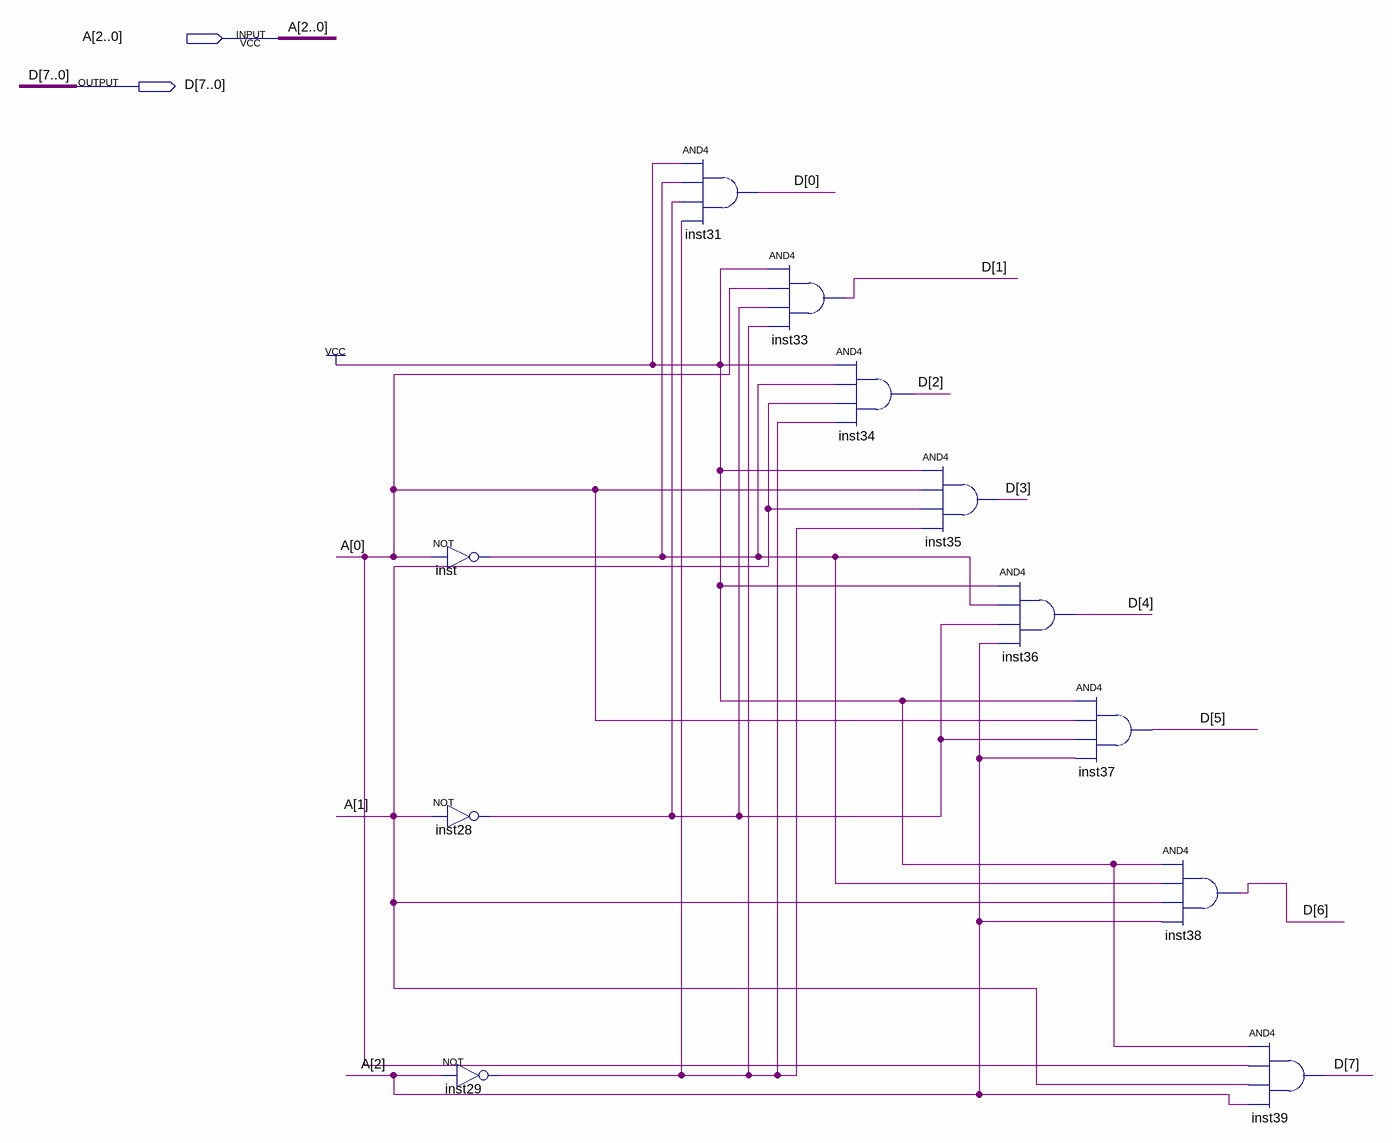
[diagram p0: schematic sheet]
// Quartus schematic decoder3_8.bdf as structural Verilog: 11 symbols, 2 pins
module decoder3_8 (
  input  [2:0] A,
  output [7:0] D
);

  wire inst28_out, inst29_out, inst_out;

  not inst (inst_out, A[0]);
  not inst28 (inst28_out, A[1]);
  not inst29 (inst29_out, A[2]);
  and inst31 (D[0], 1'b1, inst_out, inst28_out, inst29_out);
  and inst33 (D[1], 1'b1, A[0], inst28_out, inst29_out);
  and inst34 (D[2], 1'b1, inst_out, A[1], inst29_out);
  and inst35 (D[3], 1'b1, A[0], A[1], inst29_out);
  and inst36 (D[4], 1'b1, inst_out, inst28_out, A[2]);
  and inst37 (D[5], 1'b1, A[0], inst28_out, A[2]);
  and inst38 (D[6], 1'b1, inst_out, A[1], A[2]);
  and inst39 (D[7], 1'b1, A[0], A[1], A[2]);
endmodule
